# EAGLE design Hand (EAGLE 7.2.0)
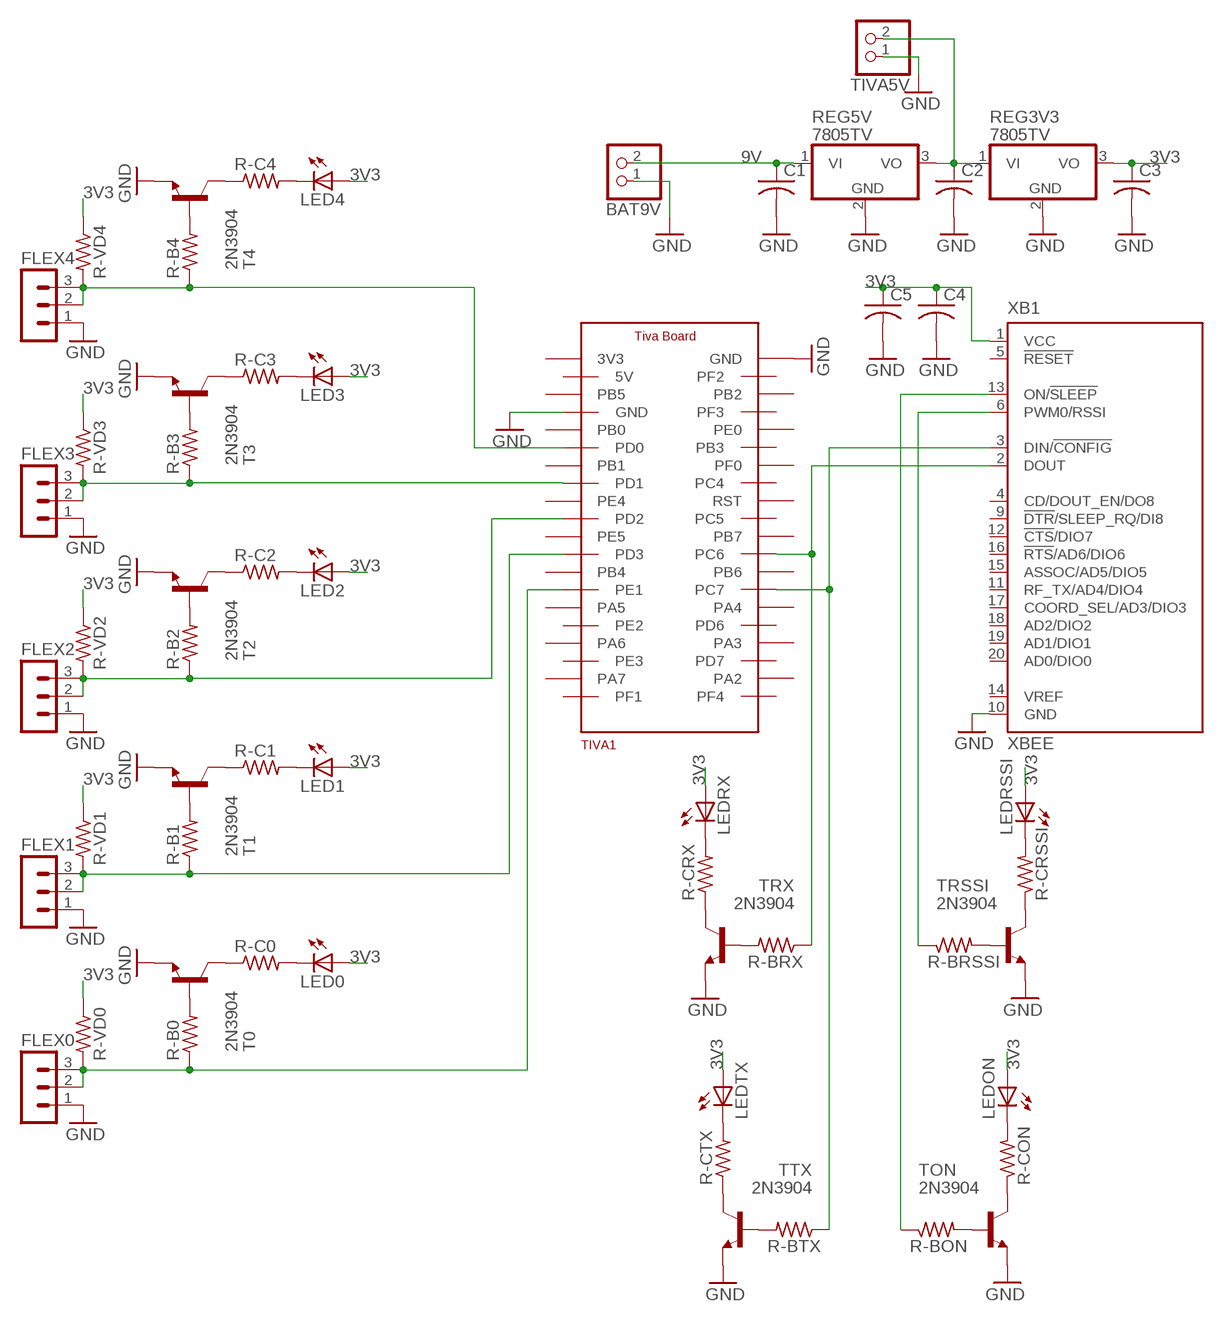
[diagram p0: schematic, sheet 1]

## Parts
BAT9V  PINHD-1X2  [1X02]
C1  C-US025-025X050  [C025-025X050]
C2  C-US025-025X050  [C025-025X050]
C3  C-US025-025X050  [C025-025X050]
C4  C-US025-025X050  [C025-025X050]
C5  C-US025-025X050  [C025-025X050]
FLEX0  MA03-1  [MA03-1]
FLEX1  MA03-1  [MA03-1]
FLEX2  MA03-1  [MA03-1]
FLEX3  MA03-1  [MA03-1]
FLEX4  MA03-1  [MA03-1]
LED0  LED5MM  [LED5MM]
LED1  LED5MM  [LED5MM]
LED2  LED5MM  [LED5MM]
LED3  LED5MM  [LED5MM]
LED4  LED5MM  [LED5MM]
LEDON  LED5MM  [LED5MM]
LEDRSSI  LED5MM  [LED5MM]
LEDRX  LED5MM  [LED5MM]
LEDTX  LED5MM  [LED5MM]
R-B0  R-US_0204/7  [0204/7]
R-B1  R-US_0204/7  [0204/7]
R-B2  R-US_0204/7  [0204/7]
R-B3  R-US_0204/7  [0204/7]
R-B4  R-US_0204/7  [0204/7]
R-BON  R-US_0204/7  [0204/7]
R-BRSSI  R-US_0204/7  [0204/7]
R-BRX  R-US_0204/7  [0204/7]
R-BTX  R-US_0204/7  [0204/7]
R-C0  R-US_0204/7  [0204/7]
R-C1  R-US_0204/7  [0204/7]
R-C2  R-US_0204/7  [0204/7]
R-C3  R-US_0204/7  [0204/7]
R-C4  R-US_0204/7  [0204/7]
R-CON  R-US_0204/7  [0204/7]
R-CRSSI  R-US_0204/7  [0204/7]
R-CRX  R-US_0204/7  [0204/7]
R-CTX  R-US_0204/7  [0204/7]
R-VD0  R-US_0204/7  [0204/7]
R-VD1  R-US_0204/7  [0204/7]
R-VD2  R-US_0204/7  [0204/7]
R-VD3  R-US_0204/7  [0204/7]
R-VD4  R-US_0204/7  [0204/7]
REG3V3  7805TV  [TO220V]
REG5V  7805TV  [TO220V]
T0  2N3904  [TO92]
T1  2N3904  [TO92]
T2  2N3904  [TO92]
T3  2N3904  [TO92]
T4  2N3904  [TO92]
TIVA1  TIVA-BOARD  [TIVA-BOARD]
TIVA5V  PINHD-1X2  [1X02]
TON  2N3904  [TO92]
TRSSI  2N3904  [TO92]
TRX  2N3904  [TO92]
TTX  2N3904  [TO92]
XB1  XBEE  [XBEE]

## Nets
3V3: C3.1 C4.1 C5.1 LED0.A LED1.A LED2.A LED3.A LED4.A LEDON.A LEDRSSI.A LEDRX.A LEDTX.A R-VD0.1 R-VD1.1 R-VD2.1 R-VD3.1 R-VD4.1 REG3V3.3(VO) XB1.1(VCC)
5V: C2.1 REG3V3.1(VI) REG5V.3(VO) TIVA5V.2
9V: BAT9V.2 C1.1 REG5V.1(VI)
GND: BAT9V.1 C1.2 C2.2 C3.2 C4.2 C5.2 FLEX0.1 FLEX1.1 FLEX2.1 FLEX3.1 FLEX4.1 REG3V3.2(GND) REG5V.2(GND) T0.3(E) T1.3(E) T2.3(E) T3.3(E) T4.3(E) TIVA1.GND@1(GND) TIVA1.GND@2(GND) TIVA5V.1 TON.3(E) TRSSI.3(E) TRX.3(E) TTX.3(E) XB1.10(GND)
N$1: FLEX0.2 FLEX0.3 R-B0.1 R-VD0.2 TIVA1.PE1
N$2: R-C1.1 T1.1(C)
N$3: LED1.K(C) R-C1.2
N$4: R-C2.1 T2.1(C)
N$5: R-B0.2 T0.2(B)
N$6: R-C3.1 T3.1(C)
N$7: LED3.K(C) R-C3.2
N$8: R-C4.1 T4.1(C)
N$9: FLEX1.2 FLEX1.3 R-B1.1 R-VD1.2 TIVA1.PD3
N$10: R-B1.2 T1.2(B)
N$11: LED4.K(C) R-C4.2
N$12: LED2.K(C) R-C2.2
N$13: FLEX2.2 FLEX2.3 R-B2.1 R-VD2.2 TIVA1.PD2
N$14: R-B2.2 T2.2(B)
N$15: R-C0.1 T0.1(C)
N$16: LED0.K(C) R-C0.2
N$17: FLEX3.2 FLEX3.3 R-B3.1 R-VD3.2 TIVA1.PD1
N$18: R-B3.2 T3.2(B)
N$19: R-BTX.1 TIVA1.PC7 XB1.3(DIN/!CONFIG)
N$20: R-BRX.1 TIVA1.PC6 XB1.2(DOUT)
N$21: FLEX4.2 FLEX4.3 R-B4.1 R-VD4.2 TIVA1.PD0
N$22: R-B4.2 T4.2(B)
N$23: R-BTX.2 TTX.2(B)
N$24: R-CTX.1 TTX.1(C)
N$25: LEDTX.K(C) R-CTX.2
N$26: R-BRX.2 TRX.2(B)
N$27: R-CRX.1 TRX.1(C)
N$28: LEDRX.K(C) R-CRX.2
N$29: R-BRSSI.1 XB1.6(PWM0/RSSI)
N$30: R-BON.1 XB1.13(ON/!SLEEP)
N$31: R-BRSSI.2 TRSSI.2(B)
N$32: R-CRSSI.1 TRSSI.1(C)
N$33: LEDRSSI.K(C) R-CRSSI.2
N$34: R-BON.2 TON.2(B)
N$35: R-CON.1 TON.1(C)
N$36: LEDON.K(C) R-CON.2
Unconnected: TIVA1.3.3V(3V3) TIVA1.5V TIVA1.PA2 TIVA1.PA3 TIVA1.PA4 TIVA1.PA5 TIVA1.PA6 TIVA1.PA7 TIVA1.PB0 TIVA1.PB1 TIVA1.PB2 TIVA1.PB3 TIVA1.PB4 TIVA1.PB5 TIVA1.PB6 TIVA1.PB7 TIVA1.PC4 TIVA1.PC5 TIVA1.PD6 TIVA1.PD7 TIVA1.PE0 TIVA1.PE2 TIVA1.PE3 TIVA1.PE4 TIVA1.PE5 TIVA1.PF0 TIVA1.PF1 TIVA1.PF2 TIVA1.PF3 TIVA1.PF4 TIVA1.RST XB1.4(CD/DOUT_EN/DO8) XB1.5(!RESET) XB1.9(!DTR!/SLEEP_RQ/DI8) XB1.11(RF_TX/AD4/DIO4) XB1.12(!CTS!/DIO7) XB1.14(VREF) XB1.15(ASSOC/AD5/DIO5) XB1.16(!RTS!/AD6/DIO6) XB1.17(COORD_SEL/AD3/DIO3) XB1.18(AD2/DIO2) XB1.19(AD1/DIO1) XB1.20(AD0/DIO0)

## Library data of the parts
BAT9V TIVA5V = pinhead:PINHD-1X2: PIN HEADER
C1-C5 = rcl:C-US: CAPACITOR, American symbol
FLEX0 FLEX1-FLEX4 = con-lstb:MA03-1: PIN HEADER; OC_FARNELL: unknown; OC_NEWARK: unknown
LED0 LED1-LED4 LEDON LEDRSSI LEDRX LEDTX = led:LED: LED OSRAM: - CHIPLED LG R971, LG N971, LY N971, LG Q971, LY Q971, LO R971, LY R971 LH N974, LH R974 LS Q976, LO Q976, LY Q976 LO Q996 - Hyper CHIPLED LW Q18S LB Q993, LB Q99A, LB R99A - SideLED LS A670, LO A670, LY A670, LG A670, LP A670 LB A673, LV A673, LT A673, LW A673 LH A674 LY A675 LS A676, LA A676, LO A676, LY A676, LW A676 LS A679, LY A679, LG A679 - Hyper Micro SIDELED® LS Y876, LA Y876, LO Y876, LY Y876 LT Y87S - SmartLED LW L88C, LW L88S LB L89C, LB L89S, LG L890 LS L89K, LO L89K, LY L89K LS L896, LA L896, LO L896, LY L896 - TOPLED LS T670, LO T670, LY T670, LG T670, LP T670 LSG T670, LSP T670, LSY T670, LOP T670, LYG T670 LG T671, LOG T671, LSG T671 LB T673, LV T673, LT T673, LW T673 LH T674 LS T676, LA T676, LO T676, LY T676, LB T676, LH T676, LSB T676, LW T676 LB T67C, LV T67C, LT T67C, LS T67K, LO T67K, LY T67K, LW E67C LS E67B, LA E67B, LO E67B, LY E67B, LB E67C, LV E67C, LT E67C LW T67C LS T679, LY T679, LG T679 LS T770, LO T770, LY T770, LG T770, LP T770 LB T773, LV T773, LT T773, LW T773 LH T774 LS E675, LA E675, LY E675, LS T675 LS T776, LA T776, LO T776, LY T776, LB T776 LHGB T686 LT T68C, LB T68C - Hyper Mini TOPLED® LB M676 - Mini TOPLED Santana® LG M470 LS M47K, LO M47K, LY M47K Source: http://www.osram.convergy.de LUXEON: - LUMILED® LXK2-PW12-R00, LXK2-PW12-S00, LXK2-PW14-U00, LXK2-PW14-V00 LXK2-PM12-R00, LXK2-PM12-S00, LXK2-PM14-U00 LXK2-PE12-Q00, LXK2-PE12-R00, LXK2-PE12-S00, LXK2-PE14-T00, LXK2-PE14-U00 LXK2-PB12-K00, LXK2-PB12-L00, LXK2-PB12-M00, LXK2-PB14-N00, LXK2-PB14-P00, LXK2-PB14-Q00 LXK2-PR12-L00, LXK2-PR12-M00, LXK2-PR14-Q00, LXK2-PR14-R00 LXK2-PD12-Q00, LXK2-PD12-R00, LXK2-PD12-S00 LXK2-PH12-R00, LXK2-PH12-S00 LXK2-PL12-P00, LXK2-PL12-Q00, LXK2-PL12-R00 Source: www.luxeon.com KINGBRIGHT: KA-3528ASYC Source: www.kingbright.com
R-B0 R-B1-R-B4 R-BON R-BRSSI R-BRX R-BTX R-C0 R-C1-R-C4 R-CON R-CRSSI R-CRX R-CTX R-VD0 R-VD1-R-VD4 = resistor:R-US_: RESISTOR, American symbol
REG3V3 REG5V = linear:78*: Positive VOLTAGE REGULATOR Source: http://cache.national.com/ds/LM/LM78L05.pdf http://www.fairchildsemi.com/ds/LM/LM7805.pdf
T0 T1-T4 TON TRSSI TRX TTX = transistor:2N3904: NPN TRANSISTOR
TIVA1 = tiva-board:TIVA-BOARD
XB1 = maxstream:XBEE: XBee (TM) /XBee-PRO(TM) OEM RF Modules Source: MaxStream, Inc. xbee_productmanual.pdf; MPN: XBP24-Z7UIT-004; OC_FARNELL: 1751799; OC_NEWARK: 34R5507

## Board
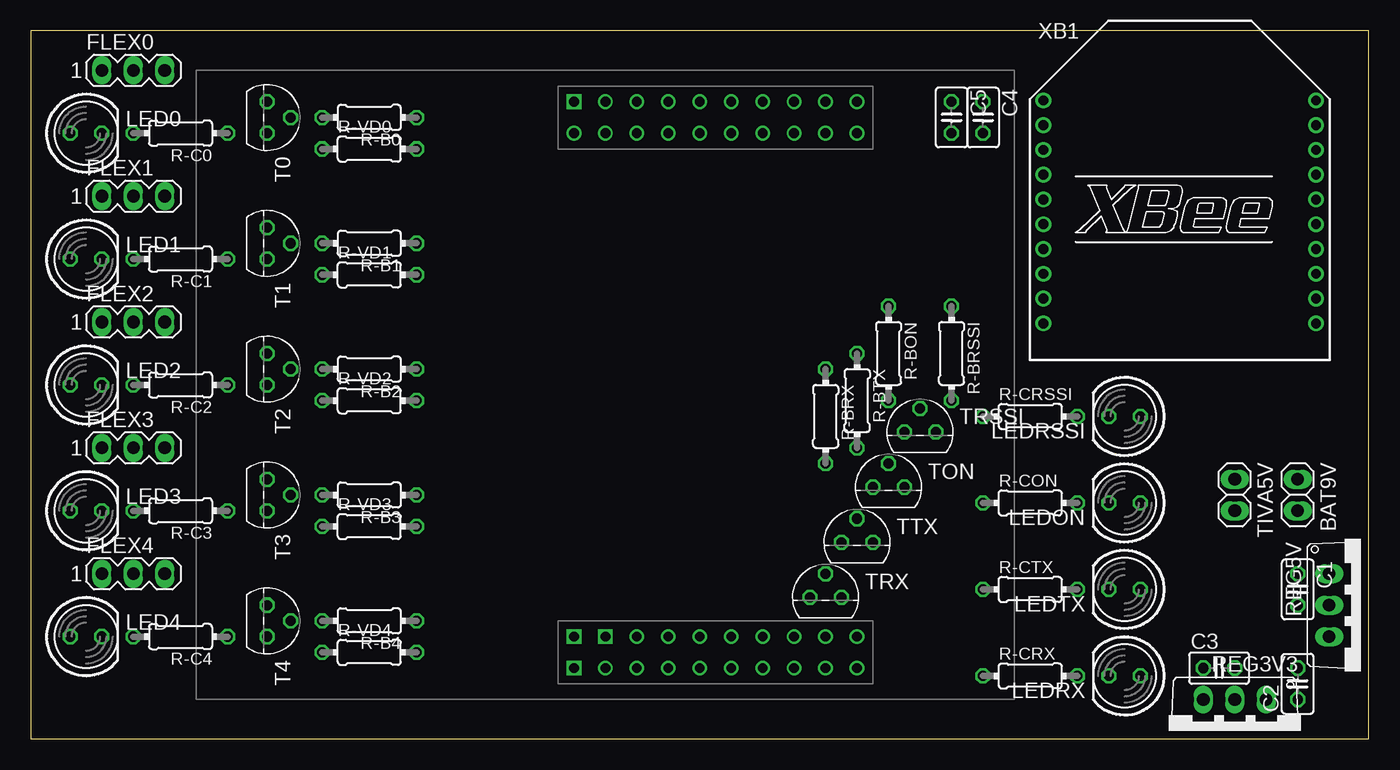
[diagram p1: board, top side]
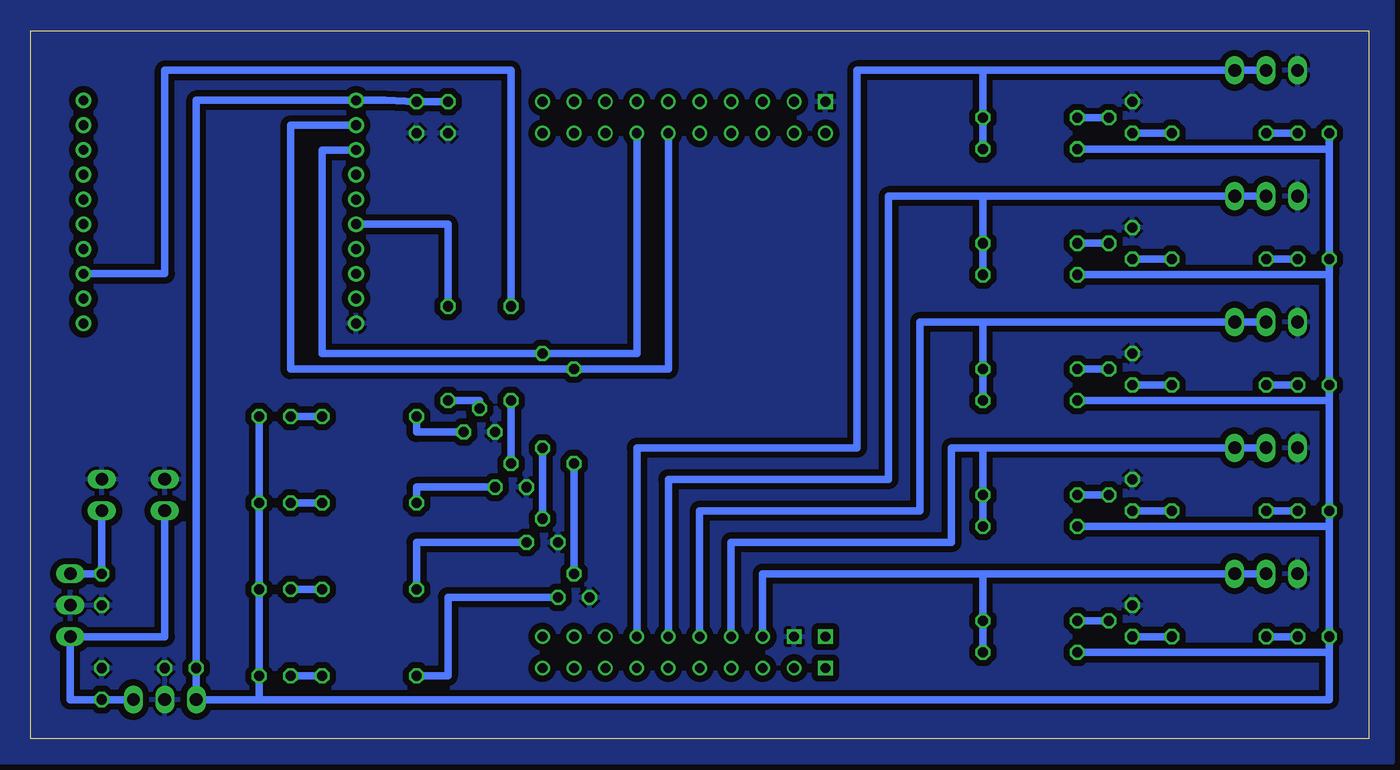
[diagram p2: board, bottom side, seen from below]

Size 107.95 x 57.15 mm. Coordinates in mm from the lower left corner, seen from the top.
Outline: 0,0 107.95,0 107.95,57.15 0,57.15 0,0
Copper layers (1*16): Top 0.035mm / dielectric 1.5mm / Bottom 0.035mm
Design rules "OthermillDRC_1_64_v2": minimum track width 16mil, minimum drill 31mil, track to track 0.39878125mm, track to pad 0.39878125mm, pad to pad 0.39878125mm, via to via 0.39878125mm, smd to smd 0mil, copper to edge 0mil, drill to drill 1mil, minimum pad ring 0mil, minimum via ring 15mil, stop-mask expansion 1mil, vias tented up to drill 30mil, thermal gap 10mil

### Footprints (pad centres in the part's own frame; a part is rotated, then mirrored left to right if it is on the bottom)
1X02 = drill 1.016 long: 1 -1.27,0; 2 1.27,0
C025-025X050 = drill 0.813 octagon: 1 -1.27,0; 2 1.27,0
MA03-1 = drill 1.016 long: 1 -2.54,0; 2 0,0; 3 2.54,0
LED5MM = drill 0.813 octagon: A -1.27,0; K 1.27,0
0204/7 = drill 0.813 octagon: 1 -3.81,0; 2 3.81,0
TO220V = drill 1.016 long: 1 -2.54,-2.54; 2 0,-2.54; 3 2.54,-2.54
TO92 = drill 0.813 octagon: 1 1.27,0; 2 0,1.905; 3 -1.27,0
TIVA-BOARD = drill 0.8 square: 3.3V -22.86,2.54; 5V -20.32,2.54; GND@1 -20.32,0; GND@2 22.86,2.54 | drill 0.8: PA2 22.86,-20.32; PA3 22.86,-17.78; PA4 22.86,-15.24; PA5 -22.86,-15.24; PA6 -22.86,-17.78; PA7 -22.86,-20.32; PB0 -22.86,-2.54; PB1 -22.86,-5.08; PB2 22.86,0; PB3 20.32,-2.54; PB4 -22.86,-12.7; PB5 -22.86,0; PB6 22.86,-12.7; PB7 22.86,-10.16; PC4 20.32,-5.08; PC5 20.32,-7.62; PC6 20.32,-10.16; PC7 20.32,-12.7; PD0 -20.32,-2.54; PD1 -20.32,-5.08; PD2 -20.32,-7.62; PD3 -20.32,-10.16; PD6 20.32,-15.24; PD7 20.32,-17.78; PE0 22.86,-2.54; PE1 -20.32,-12.7; PE2 -20.32,-15.24; PE3 -20.32,-17.78; PE4 -22.86,-7.62; PE5 -22.86,-10.16; PF0 22.86,-5.08; PF1 -20.32,-20.32; PF2 20.32,2.54; PF3 20.32,0; PF4 20.32,-20.32; RST 22.86,-7.62
XBEE = drill 0.8 pad 1.27: 1 -11,9; 2 -11,7; 3 -11,5; 4 -11,3; 5 -11,1; 6 -11,-1; 7 -11,-3; 8 -11,-5; 9 -11,-7; 10 -11,-9; 11 11,-9; 12 11,-7; 13 11,-5; 14 11,-3; 15 11,-1; 16 11,1; 17 11,3; 18 11,5; 19 11,7; 20 11,9

### Placement (x,y rotation side)
BAT9V  102.23,19.69 270 top
C1  102.23,12.06 270 top
C2  102.23,4.45 90 top
C3  95.89,5.71 0 top
C4  76.84,50.16 270 top
C5  74.3,50.16 270 top
FLEX0  8.26,53.98 0 top
FLEX1  8.26,43.81 0 top
FLEX2  8.26,33.66 0 top
FLEX3  8.26,23.5 0 top
FLEX4  8.26,13.33 0 top
LED0  4.45,48.89 0 top
LED1  4.45,38.73 0 top
LED2  4.45,28.58 0 top
LED3  4.45,18.42 0 top
LED4  4.45,8.26 0 top
LEDON  88.27,19.05 180 top
LEDRSSI  88.27,26.04 180 top
LEDRX  88.27,5.08 180 top
LEDTX  88.27,12.06 180 top
R-B0  27.31,50.16 180 top
R-B1  27.31,40 180 top
R-B2  27.31,29.85 180 top
R-B3  27.31,19.69 180 top
R-B4  27.31,9.53 180 top
R-BON  69.22,31.12 270 top
R-BRSSI  74.3,31.12 270 top
R-BRX  64.14,26.04 270 top
R-BTX  66.68,27.31 270 top
R-C0  12.06,48.89 180 top
R-C1  12.06,38.73 180 top
R-C2  12.06,28.58 180 top
R-C3  12.06,18.42 180 top
R-C4  12.06,8.26 180 top
R-CON  80.65,19.05 0 top
R-CRSSI  80.65,26.04 0 top
R-CRX  80.65,5.08 0 top
R-CTX  80.65,12.06 0 top
R-VD0  27.31,47.62 0 top
R-VD1  27.31,37.46 0 top
R-VD2  27.31,27.31 0 top
R-VD3  27.31,17.15 0 top
R-VD4  27.31,6.98 0 top
REG3V3  97.16,0.64 180 top
REG5V  107.32,10.79 270 top
T0  19.05,50.16 270 top
T1  19.05,40 270 top
T2  19.05,29.85 270 top
T3  19.05,19.69 270 top
T4  19.05,9.53 270 top
TIVA1  46.35,28.58 90 top
TIVA5V  97.16,19.69 270 top
TON  69.22,20.32 0 top
TRSSI  71.76,24.77 0 top
TRX  64.14,11.43 0 top
TTX  66.68,15.88 0 top
XB1  92.71,42.54 0 top

### Tracks (layer width: path | path; a pad name or v marks a point on that pad's centre or on a via)
3V3
  Bottom 0.61: C5.1 C4.1 79.38,51.54 XB1.1 94.62,51.54 REG3V3.3 | REG3V3.3 89.54,3.17 | 89.54,3.17 3.17,3.17 3.17,6.98 | REG3V3.3 C3.1 | R-VD1.1 3.17,37.46 | 3.17,27.31 LED2.A 3.17,37.46 | R-VD2.1 3.17,27.31 | 3.17,27.31 LED3.A 3.17,17.15 | R-VD3.1 3.17,17.15 | 3.17,6.98 LED4.A 3.17,17.15 | R-VD4.1 3.17,6.98 | 3.17,37.46 LED1.A 3.17,47.62 | LED0.A 3.17,47.62 | R-VD0.1 3.17,47.62 | 89.54,3.17 LEDRX.A LEDTX.A LEDON.A LEDRSSI.A
5V
  Bottom 0.61: REG3V3.1 C2.1 104.78,3.17 REG5V.3 97.16,8.26 TIVA5V.2
9V
  Bottom 0.61: REG5V.1 C1.1 BAT9V.2
GND
  pour Bottom (isolate 0.508): -1.91,-1.91 132.72,-1.91 132.72,104.78 -1.91,104.78
N$1
  Bottom 0.61: FLEX0.2 FLEX0.3 31.12,53.98 | 31.12,53.98 41.27,53.98 41.27,23.5 59.05,23.5 TIVA1.PE1 | 31.12,53.98 R-B0.1 R-VD0.2
N$2
  Bottom 0.61: R-C1.1 T1.1
N$3
  Bottom 0.61: R-C1.2 LED1.K
N$4
  Bottom 0.61: R-C2.1 T2.1
N$5
  Bottom 0.61: R-B0.2 T0.2
N$6
  Bottom 0.61: R-C3.1 T3.1
N$7
  Bottom 0.61: R-C3.2 LED3.K
N$8
  Bottom 0.61: R-C4.1 T4.1
N$9
  Bottom 0.61: FLEX1.2 FLEX1.3 31.12,43.81 | 31.12,43.81 38.73,43.81 38.73,20.96 56.52,20.96 TIVA1.PD3 | R-VD1.2 R-B1.1 31.12,43.81
N$10
  Bottom 0.61: T1.2 R-B1.2
N$11
  Bottom 0.61: LED4.K R-C4.2
N$12
  Bottom 0.61: LED2.K R-C2.2
N$13
  Bottom 0.61: FLEX2.2 FLEX2.3 31.12,33.66 | 31.12,33.66 36.2,33.66 36.2,18.42 53.98,18.42 TIVA1.PD2 | R-VD2.2 R-B2.1 31.12,33.66
N$14
  Bottom 0.61: T2.2 R-B2.2
N$15
  Bottom 0.61: R-C0.1 T0.1
N$16
  Bottom 0.61: LED0.K R-C0.2
N$17
  Bottom 0.61: FLEX3.2 FLEX3.3 31.12,23.5 | 31.12,23.5 33.66,23.5 33.66,15.88 51.43,15.88 TIVA1.PD1 | R-B3.1 R-VD3.2 31.12,23.5
N$18
  Bottom 0.61: T3.2 R-B3.2
N$19
  Bottom 0.61: XB1.3 84.45,47.54 84.45,31.12 R-BTX.1 59.05,31.12 TIVA1.PC7
N$20
  Bottom 0.61: XB1.2 87,49.54 87,29.85 R-BRX.1 56.52,29.85 TIVA1.PC6
N$21
  Bottom 0.61: FLEX4.2 FLEX4.3 31.12,13.33 | 31.12,13.33 48.89,13.33 TIVA1.PD0 | R-VD4.2 R-B4.1 31.12,13.33
N$22
  Bottom 0.61: R-B4.2 T4.2
N$23
  Bottom 0.61: R-BTX.2 TTX.2
N$24
  Bottom 0.61: TTX.1 76.84,15.88 R-CTX.1
N$25
  Bottom 0.61: R-CTX.2 LEDTX.K
N$26
  Bottom 0.61: R-BRX.2 TRX.2
N$27
  Bottom 0.61: TRX.1 74.3,11.43 74.3,5.08 R-CRX.1
N$28
  Bottom 0.61: R-CRX.2 LEDRX.K
N$29
  Bottom 0.61: XB1.6 74.3,41.54 R-BRSSI.1
N$30
  Bottom 0.61: XB1.13 97.16,37.54 97.16,53.98 69.22,53.98 R-BON.1
N$31
  Bottom 0.61: R-BRSSI.2 71.76,27.31 TRSSI.2
N$32
  Bottom 0.61: TRSSI.1 76.84,24.77 R-CRSSI.1
N$33
  Bottom 0.61: R-CRSSI.2 LEDRSSI.K
N$34
  Bottom 0.61: R-BON.2 TON.2
N$35
  Bottom 0.61: TON.1 76.84,20.32 R-CON.1
N$36
  Bottom 0.61: R-CON.2 LEDON.K